# EAGLE design BlinkyBoard (EAGLE 6.4)
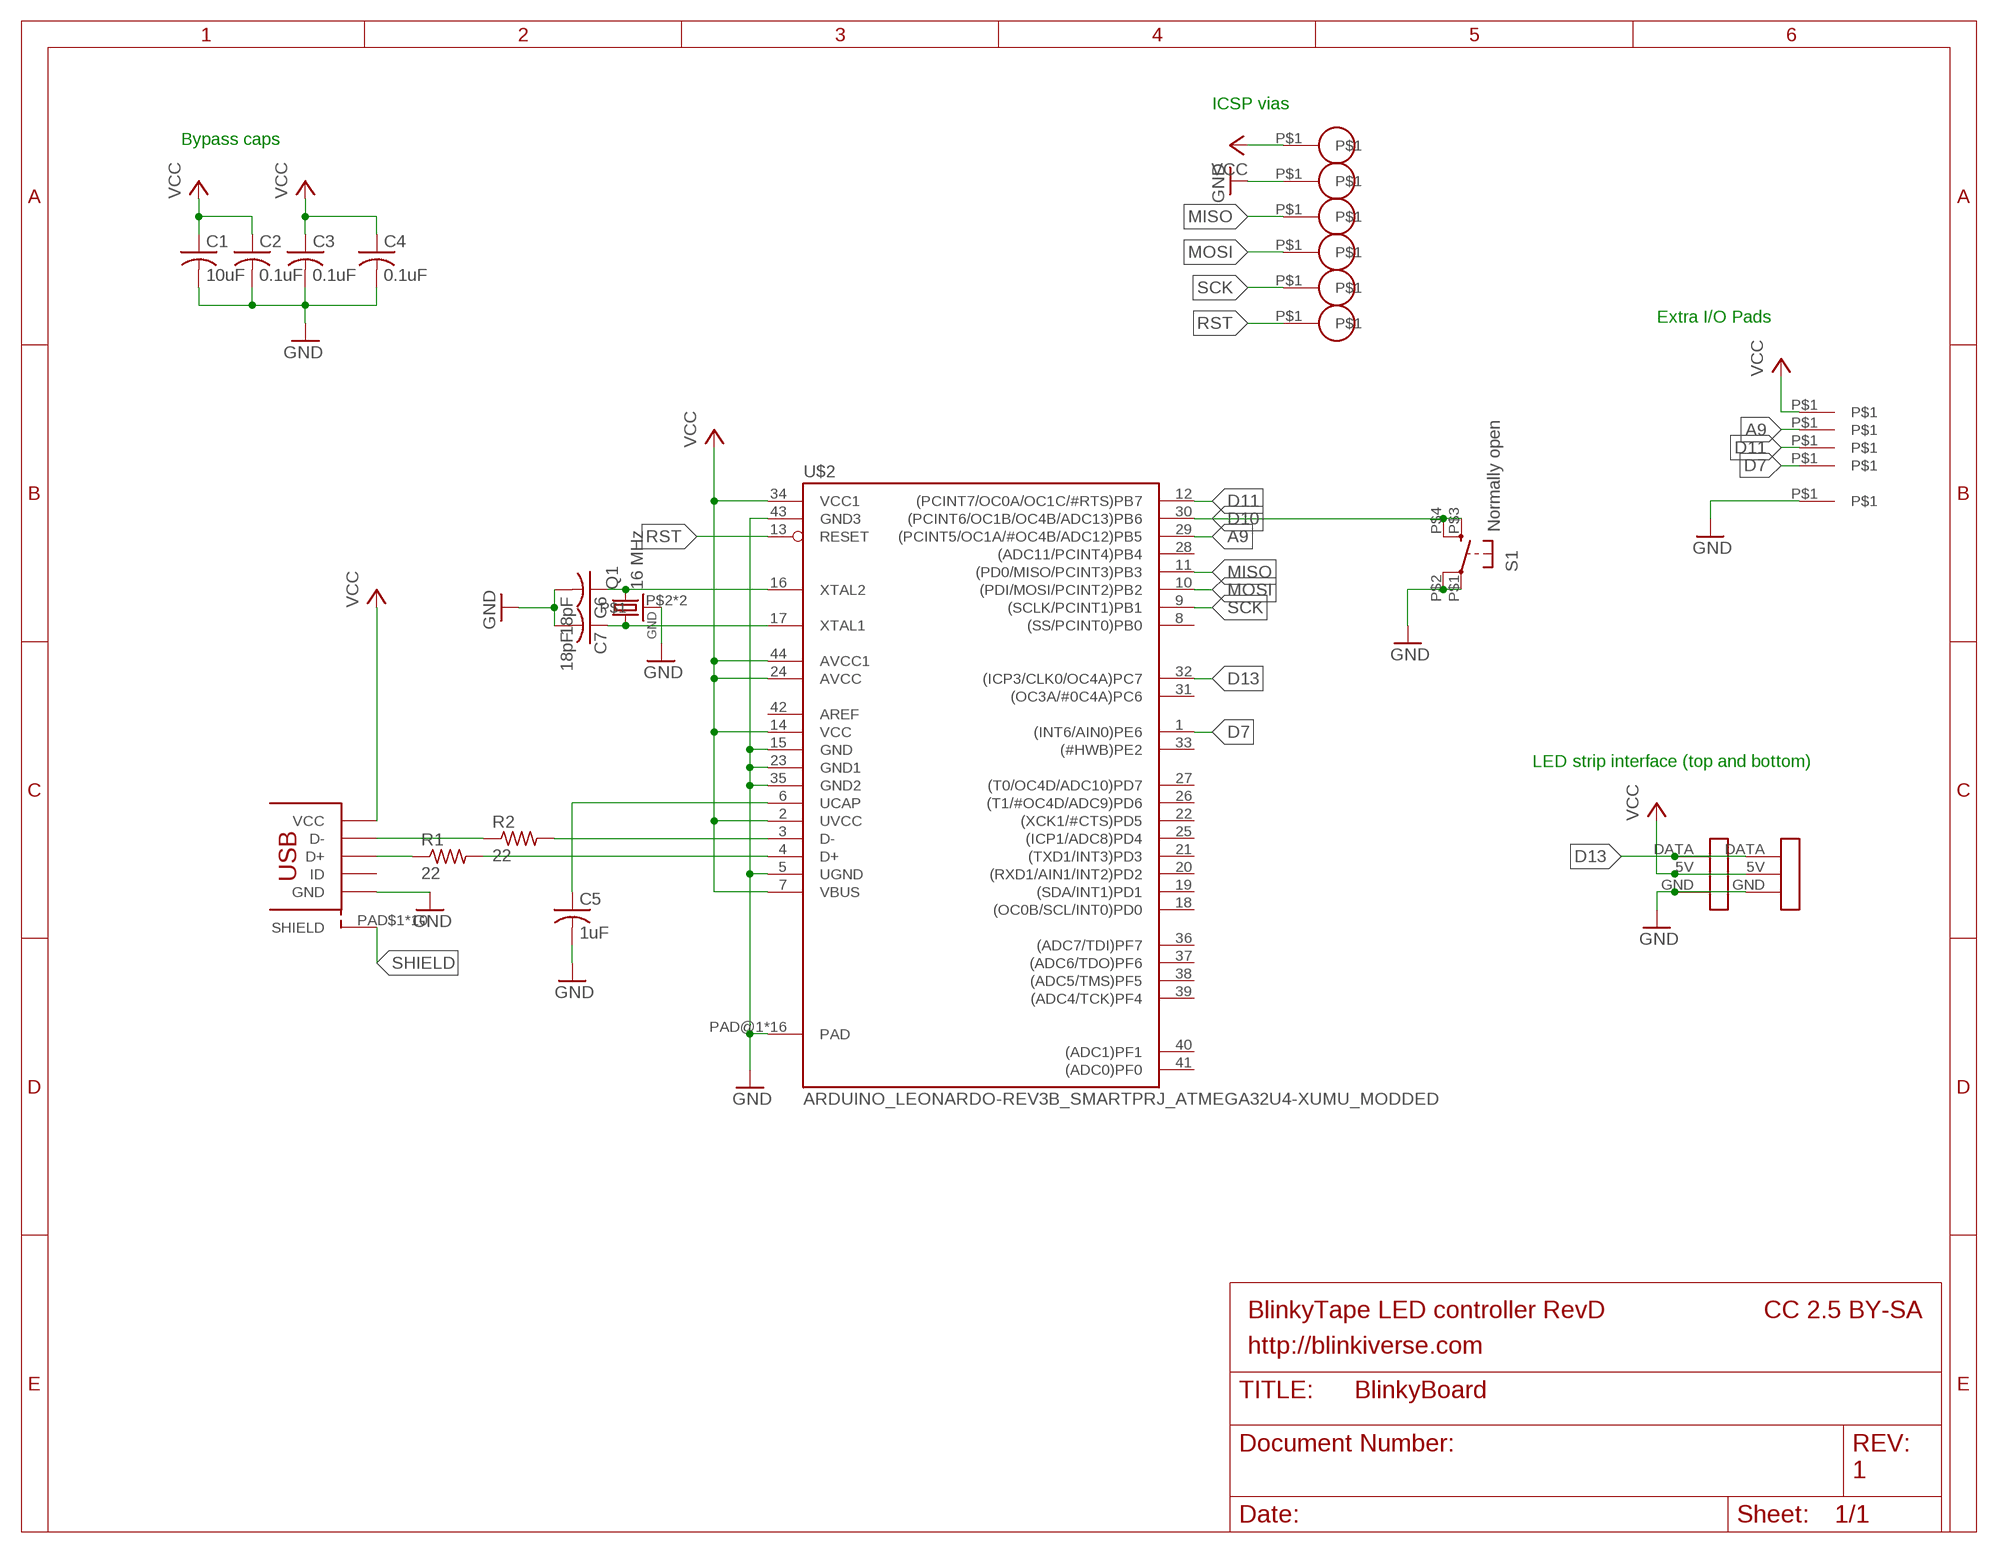
[diagram p0: schematic, sheet 1]

## Parts
C1  10uF  C-USC0603K  [C0603K]
C2  0.1uF  C_US  [CAP_0402_KEMET_MEDIAN]
C3  0.1uF  C_US  [CAP_0402_KEMET_MEDIAN]
C4  0.1uF  C_US  [CAP_0402_KEMET_MEDIAN]
C5  1uF  C_US  [CAP_0402_KEMET_MEDIAN]
C6  18pF  C_US  [CAP_0402_KEMET_MEDIAN]
C7  18pF  C_US  [CAP_0402_KEMET_MEDIAN]
Q1  16 MHz  CRYSTAL_4PAD2520  [CRSYTAL_2520]
R1  22  R_US  [RES_0402_KEMET_MEDIAN]
R2  22  R_US  [RES_0402_KEMET_MEDIAN]
S1  Normally open  GLOWBOARD_KMR211G  [GLOWBOARD_KMR211G_SWITCH]
U$1  TEST_VIA  [TEST_VIA_.5MM]
U$2  ARDUINO_LEONARDO-REV3B_SMARTPRJ_ATMEGA32U4-XUMU_MODDED  [QFN44ML_7X7_LONGLEADS_MOD]
U$3  TEST_VIA  [TEST_VIA_.5MM]
U$4  MICRO_USBSMT+THRUHULE  [MICRO_USB_FCI_THRUHOLE]
U$5  TEST_VIA  [TEST_VIA_.5MM]
U$6  TEST_VIA  [TEST_VIA_.5MM]
U$7  TEST_VIA  [TEST_VIA_.5MM]
U$8  TEST_VIA  [TEST_VIA_.5MM]
U$10  TEST_PAD_SMT  [TEST_PAD_SMT]
U$11  TEST_PAD_SMT  [TEST_PAD_SMT]
U$12  TEST_PAD_SMT  [TEST_PAD_SMT]
U$13  TEST_PAD_SMT  [TEST_PAD_SMT]
U$14  TEST_PAD_SMT  [TEST_PAD_SMT]
WS1  WS2811_CONNECTORSTRIP  [WS2811_CONNECTOR]
WS3  WS2811_CONNECTORSTRIP  [WS2811_CONNECTOR]

## Nets
A9: U$2.29((PCINT5/OC1A/#OC4B/ADC12)PB5) U$11.P$1
D7: U$2.1((INT6/AIN0)PE6) U$10.P$1
D10: S1.P$3(S) S1.P$4(S1) U$2.30((PCINT6/OC1B/OC4B/ADC13)PB6)
D11: U$2.12((PCINT7/OC0A/OC1C/#RTS)PB7) U$14.P$1
D13: U$2.32((ICP3/CLK0/OC4A)PC7) WS1.DATA WS3.DATA
D+: R1.P$2 U$2.4(D+)
D+_IN: R1.P$1 U$4.PIN$3(D+)
D-: R2.P$2 U$2.3(D-)
D-_IN: R2.P$1 U$4.PIN$2(D-)
GND: C1.2 C2.P$2 C3.P$2 C4.P$2 C5.P$2 C6.P$2 C7.P$2 Q1.P$2 Q1.P$4 S1.P$1(P) S1.P$2(P1) U$2.5(UGND) U$2.15(GND) U$2.23(GND1) U$2.35(GND2) U$2.43(GND3) U$2.PAD@1(PAD) U$2.PAD@2(PAD) U$2.PAD@3(PAD) U$2.PAD@4(PAD) U$2.PAD@5(PAD) U$2.PAD@6(PAD) U$2.PAD@7(PAD) U$2.PAD@8(PAD) U$2.PAD@9(PAD) U$2.PAD@10(PAD) U$2.PAD@11(PAD) U$2.PAD@12(PAD) U$2.PAD@13(PAD) U$2.PAD@14(PAD) U$2.PAD@15(PAD) U$2.PAD@16(PAD) U$4.PIN$5(GND) U$7.P$1 U$13.P$1 WS1.GND WS3.GND
MISO: U$1.P$1 U$2.11((PD0/MISO/PCINT3)PB3)
MOSI: U$2.10((PDI/MOSI/PCINT2)PB2) U$3.P$1
N$2: C5.P$1 U$2.6(UCAP)
N$8: C6.P$1 Q1.P$3 U$2.16(XTAL2)
N$9: C7.P$1 Q1.P$1 U$2.17(XTAL1)
RST: U$2.13(RESET) U$6.P$1
SCK: U$2.9((SCLK/PCINT1)PB1) U$5.P$1
SHIELD: U$4.PAD$1(SHIELD) U$4.PAD$2(SHIELD) U$4.PAD$3(SHIELD) U$4.PAD$4(SHIELD) U$4.PAD$5(SHIELD) U$4.PAD$6(SHIELD) U$4.PAD$7(SHIELD) U$4.PAD$8(SHIELD) U$4.PAD$9(SHIELD) U$4.PAD$10(SHIELD)
VCC: C1.1 C2.P$1 C3.P$1 C4.P$1 U$2.2(UVCC) U$2.7(VBUS) U$2.14(VCC) U$2.24(AVCC) U$2.34(VCC1) U$2.44(AVCC1) U$4.PIN$1(VCC) U$8.P$1 U$12.P$1 WS1.5V WS3.5V
Unconnected: U$2.8((SS/PCINT0)PB0) U$2.18((OC0B/SCL/INT0)PD0) U$2.19((SDA/INT1)PD1) U$2.20((RXD1/AIN1/INT2)PD2) U$2.21((TXD1/INT3)PD3) U$2.22((XCK1/#CTS)PD5) U$2.25((ICP1/ADC8)PD4) U$2.26((T1/#OC4D/ADC9)PD6) U$2.27((T0/OC4D/ADC10)PD7) U$2.28((ADC11/PCINT4)PB4) U$2.31((OC3A/#0C4A)PC6) U$2.33((#HWB)PE2) U$2.36((ADC7/TDI)PF7) U$2.37((ADC6/TDO)PF6) U$2.38((ADC5/TMS)PF5) U$2.39((ADC4/TCK)PF4) U$2.40((ADC1)PF1) U$2.41((ADC0)PF0) U$4.PIN$4(ID)

## Notes on the sheet
- ICSP vias
- Bypass caps
- Extra I/O Pads
- LED strip interface (top and bottom)
- BlinkyTape LED controller RevD | CC 2.5 BY-SA
- http://blinkiverse.com
- 1

## Power pins joined to a net without a drawn wire
AREF: U$2.42(AREF)

## Library data of the parts
C1 = adafruit:C-US: CAPACITOR, American symbol
C2-C7 = blinkiverse:C_US
Q1 = blinkiverse:CRYSTAL_4PAD
R1 R2 = blinkiverse:R_US
S1 = blinkyboard:GLOWBOARD_KMR211G: KMR211G SWITCH
U$1 U$3 U$5-U$8 = blinkiverse:TEST_VIA
U$2 = blinkiverse:ARDUINO_LEONARDO-REV3B_SMARTPRJ_ATMEGA32U4-XU
U$4 = blinkiverse:MICRO_USB
U$10-U$14 = blinkiverse:TEST_PAD_SMT
WS1 WS3 = blinkiverse:WS2811_CONNECTOR

## Board
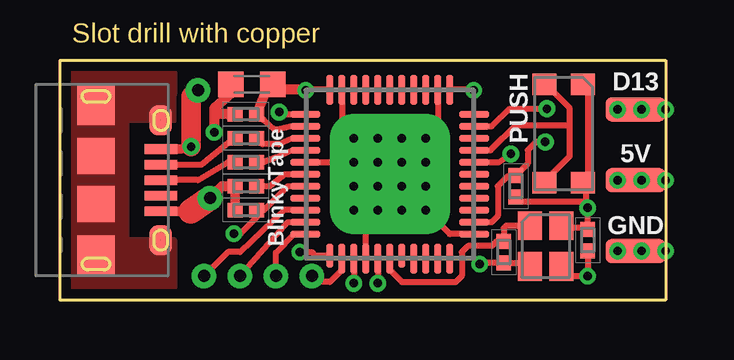
[diagram p1: board, top side]
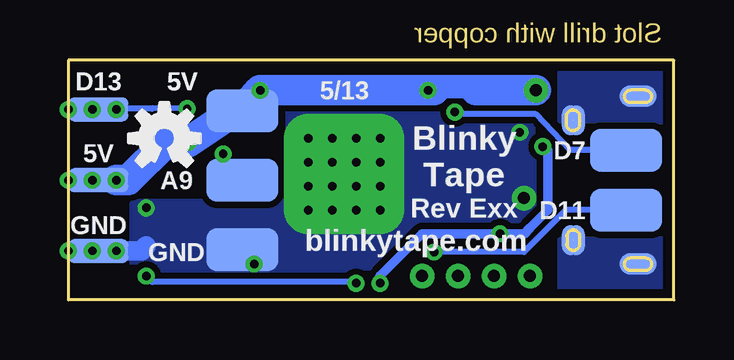
[diagram p2: board, bottom side, seen from below]

Size 25.25 x 10 mm. Coordinates in mm from the lower left corner, seen from the top.
Outline: 0,0 0,10 25.25,10 25.25,0 0,0
Copper layers (1*16): Top 0.0356mm / dielectric 1.5011mm / Bottom 0.0356mm
Design rules "BlinkyTape": minimum track width 0.25mm, minimum drill 0.35mm, track to track 0.2mm, track to pad 0.2mm, pad to pad 0.2mm, via to via 0.2mm, smd to smd 0.2mm, copper to edge 15mil, drill to drill 0.25mm, minimum pad ring 7mil, minimum via ring 7mil, stop-mask expansion 2mil, vias tented up to drill 0.35mm, thermal gap 10mil

### Footprints (pad centres in the part's own frame; a part is rotated, then mirrored left to right if it is on the bottom)
C0603K = smd 1.05 x 1.08: 1 -0.875,0; 2 0.875,0
CAP_0402_KEMET_MEDIAN = smd 0.62 x 0.62: P$1 -0.45,0; P$2 0.45,0
CRSYTAL_2520 = smd 1.2 x 1: P$1 -0.85,-0.65; P$2 0.85,-0.65; P$3 0.85,0.65; P$4 -0.85,0.65
RES_0402_KEMET_MEDIAN = smd 0.62 x 0.62: P$1 -0.45,0; P$2 0.45,0
GLOWBOARD_KMR211G_SWITCH = smd 0.9 x 1: P$1 -2,0.8; P$2 2.1,0.8; P$3 -2,-0.8; P$4 2.1,-0.8
TEST_VIA_.5MM = drill 0.5 pad 1.016: P$1 0,0
QFN44ML_7X7_LONGLEADS_MOD = smd 1.25 x 0.275: 1 -3.525,2.5; 2 -3.525,2; 3 -3.525,1.5; 4 -3.525,1; 5 -3.525,0.5; 6 -3.525,0; 7 -3.525,-0.5; 8 -3.525,-1; 9 -3.525,-1.5; 10 -3.525,-2; 11 -3.525,-2.5; 23 3.525,-2.5; 24 3.525,-2; 25 3.525,-1.5; 26 3.525,-1; 27 3.525,-0.5; 28 3.525,0; 29 3.525,0.5; 30 3.525,1; 31 3.525,1.5; 32 3.525,2; 33 3.525,2.5 | smd 0.275 x 1: 12 -2.5,-3.4; 18 0.5,-3.4 | smd 0.275 x 1.25: 13 -2,-3.525; 14 -1.5,-3.525; 15 -1,-3.525; 16 -0.5,-3.525; 17 0,-3.525; 19 1,-3.525; 20 1.5,-3.525; 21 2,-3.525; 22 2.5,-3.525; 34 2.5,3.525; 35 2,3.525; 36 1.5,3.525; 37 1,3.525; 38 0.5,3.525; 39 0,3.525; 40 -0.5,3.525; 41 -1,3.525; 42 -1.5,3.525; 43 -2,3.525; 44 -2.5,3.525 | drill 0.35 pad 2: PAD@1 -1.5,1.5; PAD@4 1.5,1.5; PAD@13 -1.5,-1.5; PAD@16 1.5,-1.5 | drill 0.35 pad 2 square: PAD@2 -0.5,1.5; PAD@3 0.5,1.5; PAD@5 -1.5,0.5; PAD@8 1.5,0.5; PAD@9 -1.5,-0.5; PAD@12 1.5,-0.5; PAD@14 -0.5,-1.5; PAD@15 0.5,-1.5 | drill 0.35 pad 1 square: PAD@6 -0.5,0.5; PAD@7 0.5,0.5; PAD@10 -0.5,-0.5; PAD@11 0.5,-0.5
MICRO_USB_FCI_THRUHOLE = smd 1.645 x 1.55: PAD$1 -3.123,0; PAD$4 3.123,0 | smd 1.5 x 1.55: PAD$2 -1,0; PAD$3 1,0 | smd 1.25 x 0.95: PAD$5 -2.5,2.7; PAD$6 2.5,2.7 | smd 0.9 x 1.55 bottom: PAD$7 -3.5,0; PAD$8 3.5,0 | smd 1.25 x 0.95 bottom: PAD$9 -2.5,2.7; PAD$10 2.5,2.7 | smd 0.4 x 1.35: PIN$1 -1.3,2.7; PIN$2 -0.65,2.7; PIN$3 0,2.7; PIN$4 0.65,2.7; PIN$5 1.3,2.7
TEST_PAD_SMT = smd 1.8 x 3: P$1 0,0
WS2811_CONNECTOR = smd 2.5 x 1: 5V 0,0; DATA 0,2.95; GND 0,-2.95

### Placement (x,y rotation side)
C1  8,9 180 top
C2  7.75,7.75 180 top
C3  7.75,3.75 180 top
C4  19,4.75 270 top
C5  7.75,4.75 180 top
C6  22,2.5 90 top
C7  18.5,2 270 top
Q1  20.25,2.25 270 top
R1  7.75,5.75 0 top
R2  7.75,6.75 0 top
S1  21,7 270 top
U$1  9,1 0 top
U$2  13.75,5.25 0 top
U$3  7.5,1 0 top
U$4  1.5,5 270 top
U$5  6,1 0 top
U$6  10.5,1 0 top
U$7  6.25,4.25 0 top
U$8  5.75,8.75 0 top
U$10  2,6.25 90 bottom
U$11  18,5 90 bottom
U$12  18,7.9 270 bottom
U$13  18,2.1 270 bottom
U$14  2,3.75 270 bottom
U$15  [OSHW-LOGO-S]  21.25,6.75 0 bottom
WS1  24,5 0 top
WS3  24,5 0 bottom

### Tracks (layer width: path | path; a pad name or v marks a point on that pad's centre or on a via)
A9  (via drill 0.35)
  Top 0.254: U$2.29 18.3,5.75 v18.8,6.1
  Bottom 0.254: U$11.P$1 18.55,5.5 v18.8,6.1
D7  (via drill 0.35)
  Top 0.254: v9.14,7.85 9.14,7.75 U$2.1
  Bottom 0.254: U$10.P$1 4.35,6.25 5.75,7.75 9.12,7.75 v9.14,7.85
D10
  Top 0.254: 20.48,8.98 S1.P$3 20.25,9 21.25,8 21.25,7.3 | S1.P$4 20.44,5.19 21.25,6 21.25,7.3 | U$2.30 17.95,6.25 19,7.3 21.25,7.3
D11  (via drill 0.35)
  Top 0.254: v10,2 10.5,2 10.65,1.85 U$2.12
  Bottom 0.254: U$14.P$1 4.5,3.75 6.25,2 v10,2
D13  (via drill 0.35)
  Top 0.254: 23.95,8 WS3.DATA | v23.25,7.95 WS3.DATA | WS3.DATA 24.05,8 v24.25,7.95 | U$2.32 18,7.25 18.75,7.98 v20.3,7.98
  Bottom 0.254: WS3.DATA 24.05,8 v24.25,7.95 v25.25,7.95 | v20.3,7.98 21.75,8 21.77,7.98 23.2,7.98 v23.25,7.95
D+
  Top 0.254: U$2.4 9.7,6.25 9,5.95 8.5,5.75 R1.P$2
D+_IN
  Top 0.254: R1.P$1 7,5.75 5.75,5 U$4.PIN$3
D-
  Top 0.254: U$2.3 9.7,6.75 9.12,6.5 8.45,6.5 R2.P$2
D-_IN
  Top 0.254: U$4.PIN$2 5.9,5.65 7.25,6.75 R2.P$1
GND  (via drill 0.35)
  Top 0.254: U$2.5 U$2.PAD@5 | U$2.15 12.75,3.25 U$2.PAD@14 | U$2.PAD@16 16.25,2.75 U$2.23 17.25,2.73 | U$2.43 11.75,7.25 U$2.PAD@1 | U$2.35 15.75,7.25 U$2.PAD@4 | v23.25,2.05 WS3.GND 24.05,2 v24.25,2.05 | C4.P$2 18.95,4.3 19,4.12 21.88,4.12 v22,3.85 | v17.5,1.5 17.55,1.55 C7.P$2 19.45,1.55 Q1.P$2 | C6.P$2 22,3 | 22,3 v22,3.85 | v22,3.85 21.93,4.07 21.93,4.75 S1.P$2 21.8,5.05 22,5.25 22,8.8 S1.P$1 | 22,3 21,3 Q1.P$4
  Top 0.4: C2.P$2 7,7.75 | 7.25,4.75 C5.P$2 C3.P$2 | U$4.PIN$5 5.45,3.7
  Top 0.406: C1.2 7.12,8.62 6.43,8 6.43,7.75 | 6.43,7.75 v6.43,7 | 7,7.75 6.43,7.75 | U$7.P$1 6.75,4.75 C5.P$2
  Top 1.016: 5.45,3.7 U$7.P$1
  Bottom 0.254: v23.25,2.05 23.3,2.05 WS3.GND | v25.25,2.05 v24.25,2.05
  Bottom 0.813: 23.3,2.05 22.2,2.05 22,2.25
  pour Bottom (isolate 0.254): 5.75,10 16,10 16,4 22.5,4 22.5,0 5.75,0
MISO
  Top 0.254: U$1.P$1 9,1.98 9.75,2.75 U$2.11
MOSI
  Top 0.254: U$2.10 9.51,3.25 U$3.P$1
N$2
  Top 0.254: C5.P$1 8.75,4.75 9.38,5.25 U$2.6
N$8  (via drill 0.35)
  Top 0.254: U$2.16 v13.25,0.7 | Q1.P$3 21.1,1 v22,1 C6.P$1
  Bottom 0.254: v13.25,0.7 13.25,0.75 21.75,0.75 v22,1
N$9
  Top 0.254: U$2.17 13.75,1.25 14.25,0.75 16.5,0.75 16.75,1 16.75,2 17,2.25 18,2.25 18.2,2.45 C7.P$1 18.5,3 18.6,3.1 Q1.P$1
RST
  Top 0.254: U$2.13 11.75,1.25 11.25,0.75 10.75,0.75 U$6.P$1
SCK
  Top 0.254: U$2.9 9.35,3.75 7.5,2 7,2 U$5.P$1
SHIELD  (2 unrouted)
  pour Top: 0.25,9.5 4.75,9.5 4.75,7.5 2.75,7.5 2.75,2.5 4.75,2.5 4.75,0.5 0.25,0.5
  pour Bottom (isolate 0.254): 0.25,9.5 4.75,9.5 4.75,7.5 2.75,7.5 2.75,2.5 4.75,2.5 4.75,0.5 0.25,0.5
VCC  (via drill 0.35)
  Top 0.254: v17.25,8.75 17,8.78 U$2.34 | U$2.14 v12.25,0.7 | U$2.44 10.22,8.78 v10.25,8.75 | U$2.24 18,3.25 18.25,3.5 18.25,4.75 18.65,5.15 C4.P$1 19.5,5.7 19.5,6.25 19.85,6.6 v20.23,6.6 | U$2.7 9.5,4.75 8.5,3.75 C3.P$1 8.2,3.45 7.5,2.75 v7.25,2.77 | v23.25,5 WS3.5V v24.25,5 | U$2.2 9.7,7.25 9.1,7.11 8.95,7.11 8.51,7.5 8.25,7.75 C2.P$1
  Top 0.4: U$4.PIN$1 5.05,6.3 v5.47,6.4
  Top 0.406: C2.P$1 8.7,9 C1.1 8.88,8.78 10.22,8.78
  Top 0.813: v5.47,6.4 5.47,8.5 U$8.P$1
  Bottom 0.254: WS3.5V v24.25,5 v25.25,5
  Bottom 0.4: v12.25,0.7 12.25,1 10.5,2.77 v7.25,2.77 6.23,2.77 6,3 5.25,3.75 5.25,6.25 v5.47,6.4
  Bottom 0.813: v23.25,5 WS3.5V
  Bottom 0.98: 8.25,8.75 8.25,8.9 10,8.9 10,8.75
  Bottom 1.27: U$8.P$1 8.25,8.75 | 10,8.75 v10.25,8.75 v17.25,8.75 U$12.P$1 18.35,7.9 18.5,7.75 v20.23,6.6 21.15,6.6 22.75,5 v23.25,5

### Text on the board
tNames: D13 | PUSH | 5V | BlinkyTape | GND
bNames: 5/13 | 5V | 5V | D13 | D7 | Blinky / Tape | 5V | A9 | D11 | Rev Exx | GND | blinkytape.com | GND
Milling: Slot drill with copper